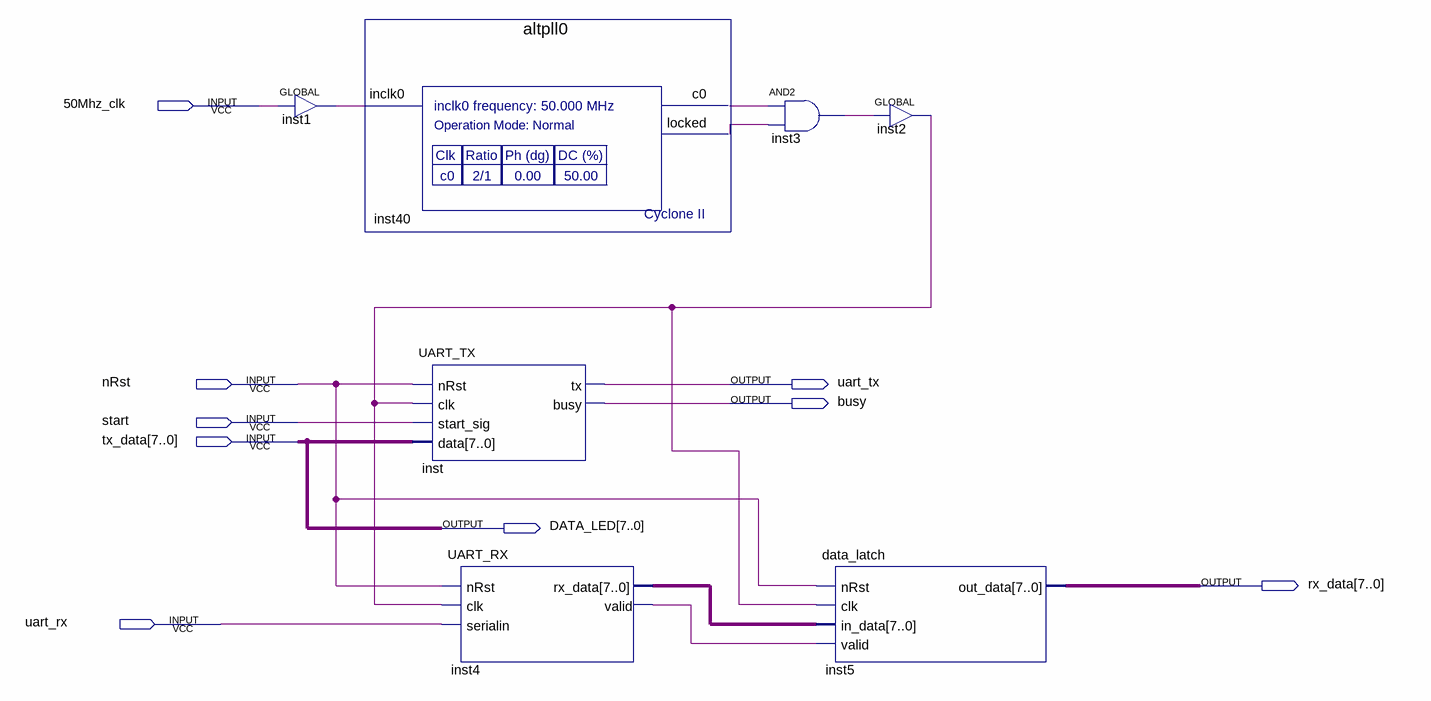
[diagram p0: schematic sheet]
// Quartus schematic UART_TX_SIM.bdf as structural Verilog: 7 symbols, 9 pins
module UART_TX_SIM (
  input  \50Mhz_clk ,
  input  nRst,
  input  start,
  input  [7:0] tx_data,
  input  uart_rx,
  output uart_tx,
  output busy,
  output [7:0] DATA_LED,
  output [7:0] rx_data
);

  wire inst1_out, inst2_out, inst3_out, inst4_valid, inst40_c0, inst40_locked;
  wire [7:0] inst4_rx_data;

  GLOBAL inst1 (.IN(\50Mhz_clk ), .OUT(inst1_out));
  altpll0 inst40 (.inclk0(inst1_out), .c0(inst40_c0), .locked(inst40_locked));
  UART_TX inst (.nRst(nRst), .clk(inst2_out), .start_sig(start), .data(tx_data), .tx(uart_tx), .busy(busy));
  UART_RX inst4 (.nRst(nRst), .clk(inst2_out), .serialin(uart_rx), .rx_data(inst4_rx_data), .valid(inst4_valid));
  and inst3 (inst3_out, inst40_c0, inst40_locked);
  data_latch inst5 (.nRst(nRst), .clk(inst2_out), .in_data(inst4_rx_data), .valid(inst4_valid), .out_data(rx_data));
  GLOBAL inst2 (.IN(inst3_out), .OUT(inst2_out));

  assign DATA_LED = tx_data;
endmodule
